# Altium schematic sheet MotorMosfet.SchDoc
size A4
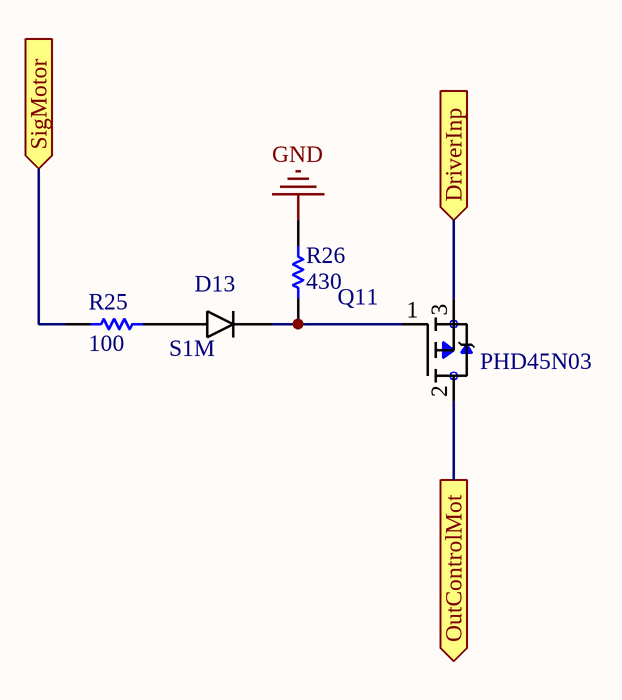
[diagram p0: MotorMosfet.SchDoc]

## Parts
D13  S1M  [*DIOM5227X270N_S1M(Primary)]
Q11  PHD45N03  [*DPAK228P998X235-3N]
R25  value 100  [6-0805_L]  (hidden comment: R100)
R26  value 430  [6-0805_L]  (hidden comment: R430)

## Ports
DriverInp (in), OutControlMot (out), SigMotor (in)

## Nets
GND: R26.1
DriverInp: Q11.3(S) ; port DriverInp
OutControlMot: Q11.2(D) ; port OutControlMot
SigMotor: R25.1 ; port SigMotor
NetD13_A: D13.A R25.2
NetD13_C: D13.C(K) Q11.1(G) R26.2

## Notes on the sheet
- Title
- Size:
- Date:
- A4
- Number:
- Time:
- Revision:
- Sheet
- of
- File:

## Library data of the parts
D13 = S1M: S1 Series 1000 V 1 A 1 uA Surface Mount General Purpose Rectifier - DO-214AC; MF: ON Semiconductor; Price: None; Availability: Unavailable; SnapEDA_Link: https://www.snapeda.com/parts/S1M/ON%20Semiconductor/view-part/?ref=snap; Package: DO-214AC-214 ON Semiconductor; MP: S1M; Value: *
Q11 = IPD50P04P4L-11: P-Channel 40 V 10.6 mOhm OptiMOSآ®-P2 Power-Transistor -PG-TO-252-3; MF: Infineon Technologies; MP: IPD50P04P4L-11; Package: TO-252-3 Infineon; Price: None; Availability: Unavailable; SnapEDA_Link: https://www.snapeda.com/parts/IPD50P04P4L-11/Infineon%20Technologies/view-part/?ref=snap; Value: *
R25 R26 = Res1: Resistor; Published: 8-Jun-2000; LatestRevisionDate: 17-Jul-2002; LatestRevisionNote: Re-released for DXP Platform.; PackageReference: AXIAL-0.3; Publisher: Altium Limited; PackageDescription: Axial Device, Thru-Hole; 2 Leads; 0.3 in Pin Spacing